# EasyEDA schematic schematic.json
TITLE: Sheet_1; REV: 1.0; Date: 2024-10-09; Sheet: 1/1; Drawn By: Ahnaf; Company: Your Company
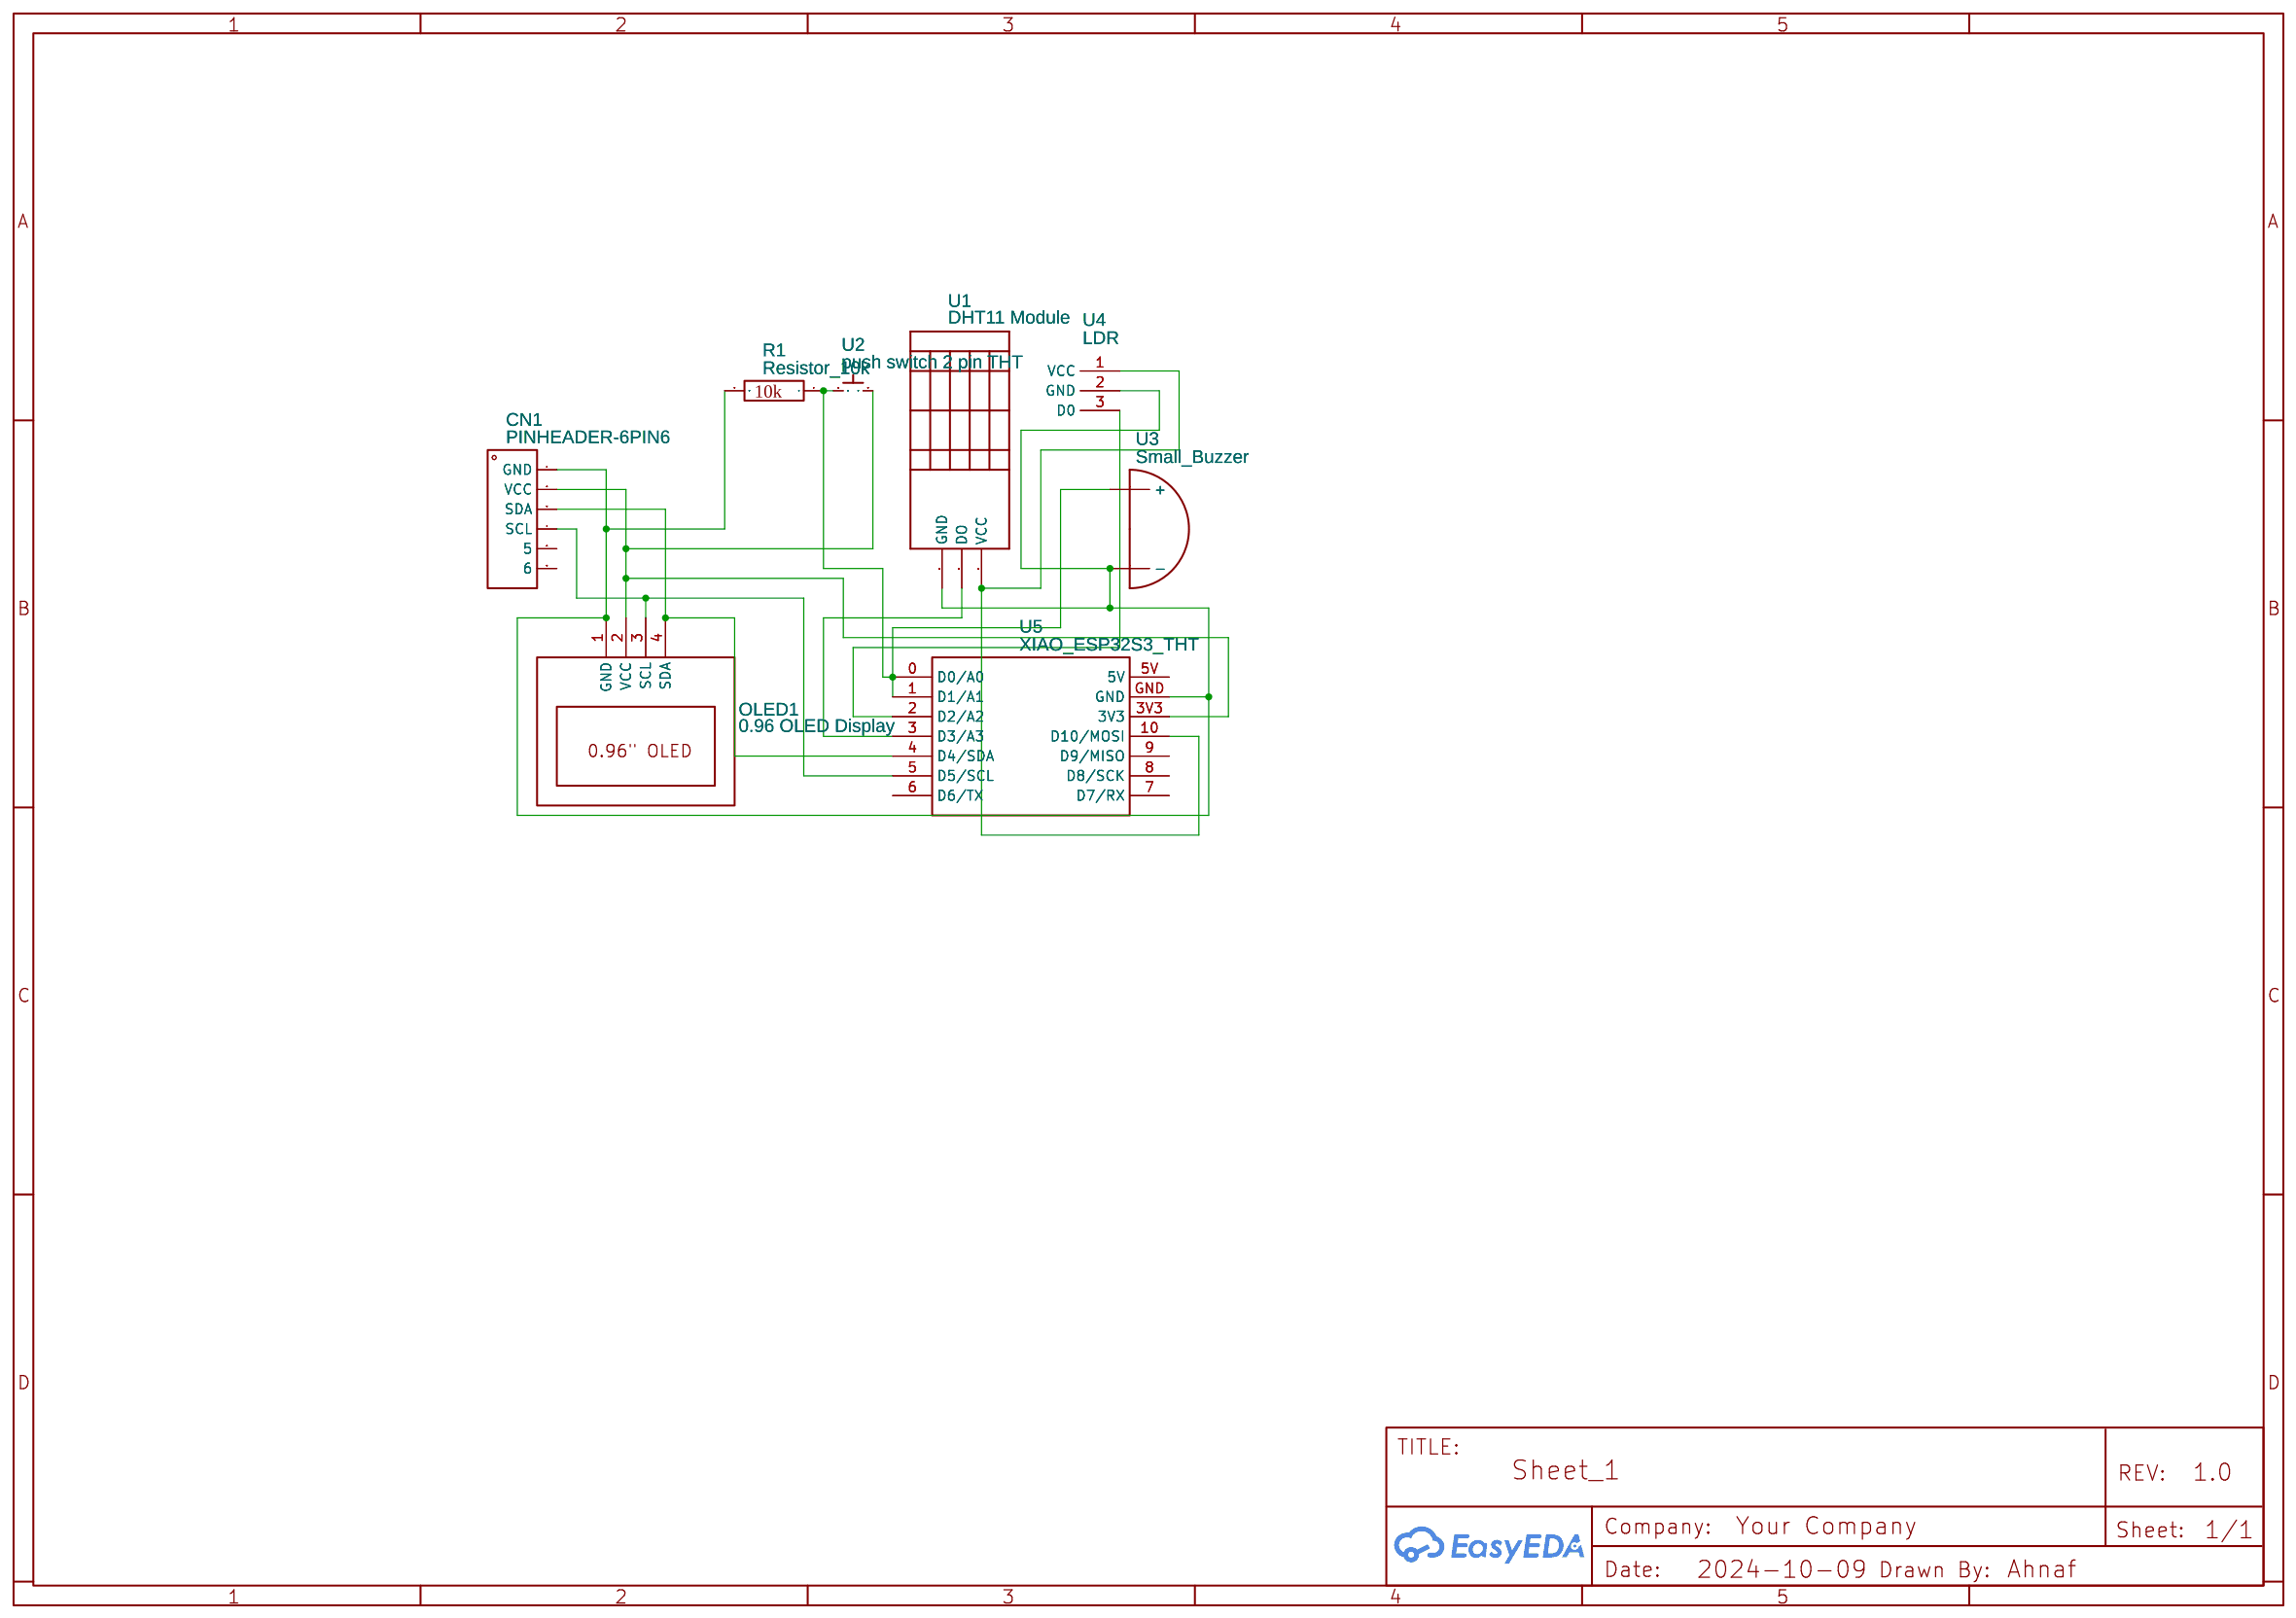
[diagram p0: schematic sheet]

## Parts
CN1  PINHEADER-6PIN6  [PINHEADER-6PIN]
OLED1  0.96 OLED Display  [0.96-OLED-DISPLAY]
R1  Resistor_10k  [RESISTOR_10K]
U1  DHT11 Module  [DHT11 MODULE]
U2  push switch 2 pin THT  [PUSH SWITCH 2 PIN THT]
U3  Small_Buzzer  [SMALL_BUZZER]
U4  LDR  [CONNECTOR_PINHEADER_2.54MM:PINHEADER_1X3]
U5  XIAO_ESP32S3_THT  [XIAO_ESP32S3_THT]

## Library data of the parts
CN1 = PINHEADER-6PIN6: Contributor: mKenfenheuer
OLED1 = 0.96OLED_4P_MODULE_JX: Supplier Part: C9900004566; Manufacturer: null; Contributor: swayam52; JLCPCB Part Class: Extended Part
R1 = Resistor_10k: Supplier Part: undefined; Supplier: Conrad; Contributor: Andrius Slunka
U1 = DHT11 Module: Contributor: fazleyelehi
U2 = push switch 2 pin THT: Contributor: fazleyelehi
U3 = Small_Buzzer: link: https://ram-e-shop.com/product/buzzar6v/; Contributor: eng.abdalrahman.seliem
U4 = 3 pinheader: Contributor: ruihan.zhao13147-bihz
U5 = XIAO_ESP32S3_THT: Contributor: maeldefoy

## Nets
Net-(CN1-1): CN1.1(GND) OLED1.1(GND) R1.2 U1.GND U3.2(-) U4.2(GND) U5.GND
Net-(CN1-2): CN1.2(VCC) OLED1.2(VCC) U2.2 U5.3V3
Net-(CN1-3): CN1.3(SDA) OLED1.4(SDA) U5.4(D4/SDA)
Net-(CN1-4): CN1.4(SCL) OLED1.3(SCL) U5.5(D5/SCL)
Net-(R1-1): R1.1 U2.1 U3.1(+) U5.0(D0/A0) U5.1(D1/A1)
Net-(U1-DO): U1.DO U5.3(D3/A3)
Net-(U1-VCC): U1.VCC U4.1(VCC) U5.10(D10/MOSI)
Net-(U4-3): U4.3(D0) U5.2(D2/A2)

Not connected (* = marked no-connect by the designer): CN1 5 6; U5 5V 6(D6/TX) 7(D7/RX) 8(D8/SCK) 9(D9/MISO)
